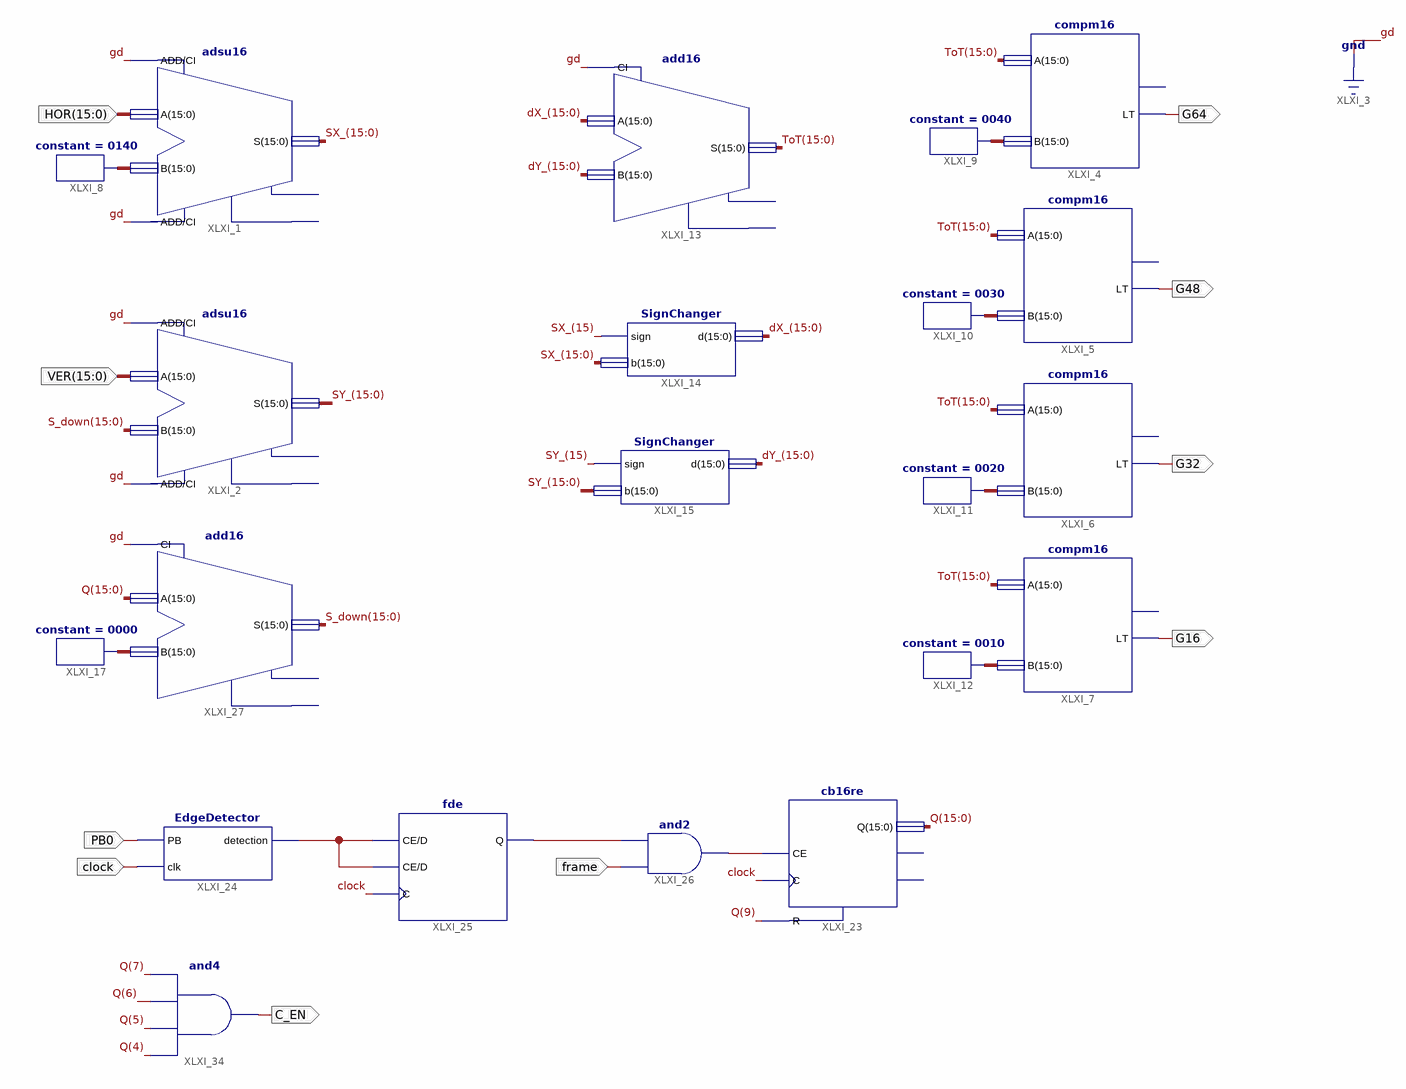
[diagram p0: schematic sheet 1]
// Xilinx ISE schematic Met_Green.sch (spartan3e) as structural Verilog: 21 symbols, 10 ports
module Met_Green (
  input  [15:0] HOR,
  input  [15:0] VER,
  input  clock,
  input  PB0,
  input  frame,
  output G64,
  output G48,
  output G32,
  output G16,
  output C_EN
);

  wire XLXN_33, XLXN_39, XLXN_44;
  wire [15:0] dX_, dY_, Q, S_down, SX_, SY_, ToT, XLXN_30, XLXN_51;

  adsu16 XLXI_1 (.A(HOR), .ADD(1'b0), .B(ToT), .CI(1'b0), .S(SX_));  // open: CO, OFL
  adsu16 XLXI_2 (.A(VER), .ADD(1'b0), .B(S_down), .CI(1'b0), .S(SY_));  // open: CO, OFL
  compm16 XLXI_4 (.A(ToT), .B(SX_), .LT(G64));  // open: GT
  compm16 XLXI_5 (.A(ToT), .B(dX_), .LT(G48));  // open: GT
  compm16 XLXI_6 (.A(ToT), .B(XLXN_30), .LT(G32));  // open: GT
  compm16 XLXI_7 (.A(ToT), .B(SY_), .LT(G16));  // open: GT
  constant #(.CValue("0140")) XLXI_8 (.O(ToT));
  constant #(.CValue("0040")) XLXI_9 (.O(SX_));
  constant #(.CValue("0030")) XLXI_10 (.O(dX_));
  constant #(.CValue("0020")) XLXI_11 (.O(XLXN_30));
  constant #(.CValue("0010")) XLXI_12 (.O(SY_));
  add16 XLXI_13 (.A(dX_), .B(dY_), .CI(1'b0), .S(ToT));  // open: CO, OFL
  SignChanger XLXI_14 (.sign(SX_[15]), .b(SX_), .d(dX_));
  SignChanger XLXI_15 (.sign(SY_[15]), .b(SY_), .d(dY_));
  add16 XLXI_27 (.A(Q), .B(XLXN_51), .CI(1'b0), .S(S_down));  // open: CO, OFL
  constant #(.CValue("0000")) XLXI_17 (.O(XLXN_51));
  EdgeDetector XLXI_24 (.PB(PB0), .clk(clock), .detection(XLXN_33));
  fde XLXI_25 (.C(clock), .CE(XLXN_33), .D(XLXN_33), .Q(XLXN_44));
  cb16re XLXI_23 (.C(clock), .CE(XLXN_39), .R(Q[9]), .Q(Q));  // open: CEO, TC
  and XLXI_26 (XLXN_39, frame, XLXN_44);
  and XLXI_34 (C_EN, Q[4], Q[5], Q[6], Q[7]);
endmodule
